# Altium schematic sheet Main.SchDoc
size A; DocumentNumber: 2; SheetNumber: 1; SheetTotal: 2
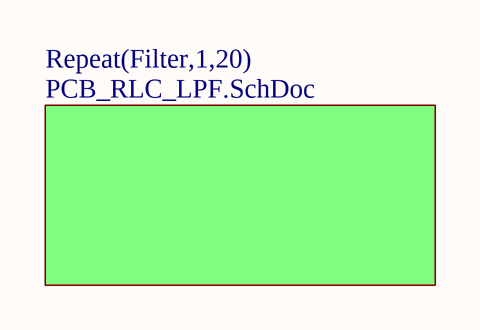
[diagram p0: Main.SchDoc]

## Sub-sheets
Repeat(Filter,1,20) = PCB_RLC_LPF.SchDoc: no entries